# EAGLE design powerswitch (EAGLE 5.11)
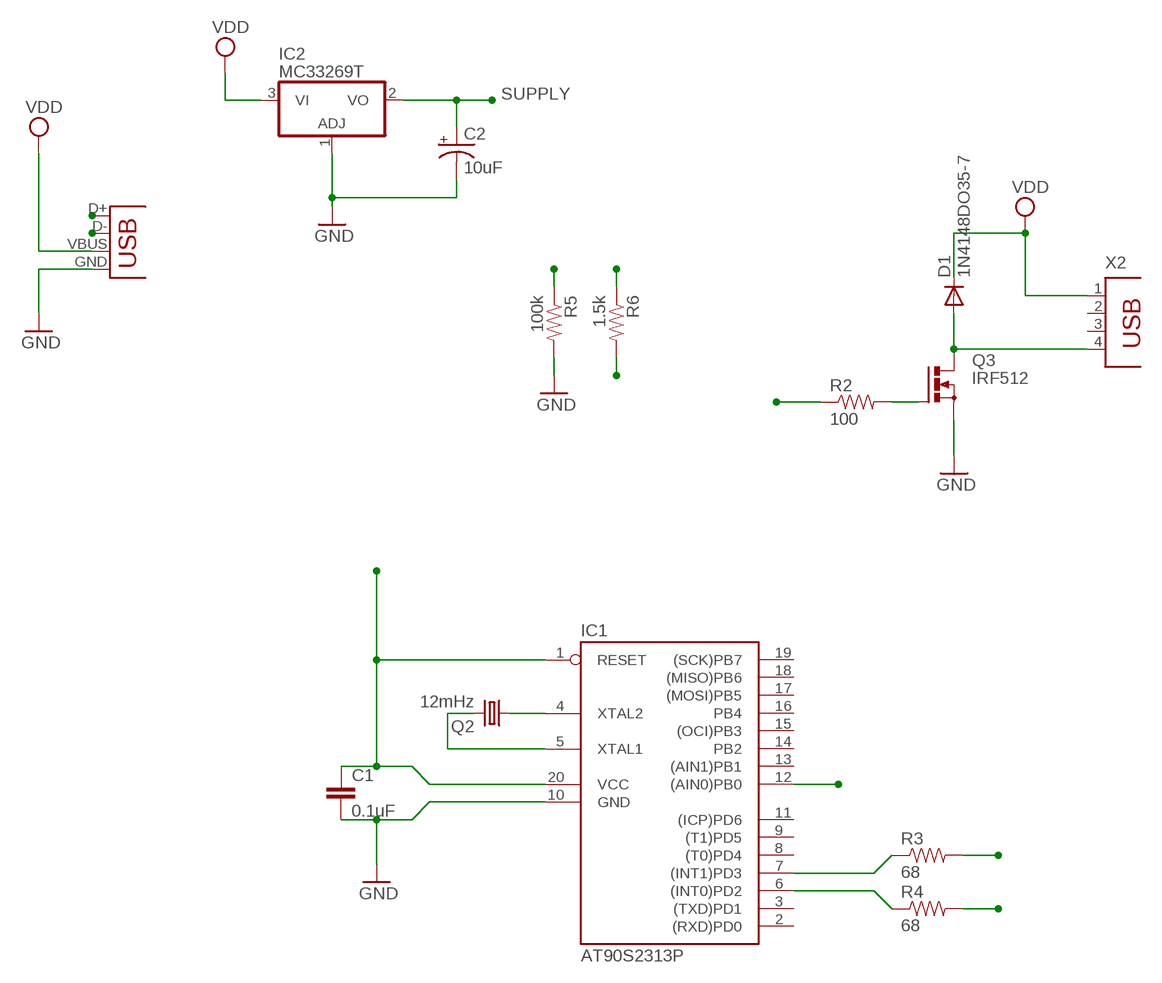
[diagram p0: schematic, sheet 1]

## Parts
C1  0.1uF  CAPPTH  [CAP-PTH-SMALL]
C2  10uF  CAP_POLPTH2  [CPOL-RADIAL-10UF-25V]
D1  1N4148DO35-7  [DO35-7]
IC1  AT90S2313P  [DIL20]
IC2  MC33269T  [TO220V]
Q2  12mHz  CRYSTALHC49U-V  [HC49U-V]
Q3  IRF512  [TO220BV]
R2  100  RESISTORKIT  [AXIAL-0.3-KIT]
R3  68  RESISTORKIT  [AXIAL-0.3-KIT]
R4  68  RESISTORKIT  [AXIAL-0.3-KIT]
R5  100k  RESISTORKIT  [AXIAL-0.3-KIT]
R6  1.5k  RESISTORKIT  [AXIAL-0.3-KIT]
X1  USBPTH  [USB-B-PTH]
X2  PN87520  [PN87520]

## Nets
D+: R4.P$2 R5.P$1 X1.D+
D-: R3.P$2 R6.P$1 X1.D-
GND: C1.2 C2.2(-) IC1.10(GND) IC2.1(ADJ) Q3.S R5.P$2 X1.GND
N$1: IC1.7((INT1)PD3) R3.P$1
N$2: D1.A Q3.D X2.4
N$4: Q3.G R2.P$2
N$5: IC1.6((INT0)PD2) R4.P$1
N$8: IC1.4(XTAL2) Q2.1
N$9: IC1.5(XTAL1) Q2.2
SUPPLY: C1.1 C2.1(+) IC1.1(RESET) IC1.20(VCC) IC2.2(VO) R6.P$2
SWITCH: IC1.12((AIN0)PB0) R2.P$1
VDD: D1.C IC2.3(VI) X1.VBUS X2.1
Unconnected: IC1.2((RXD)PD0) IC1.3((TXD)PD1) IC1.8((T0)PD4) IC1.9((T1)PD5) IC1.11((ICP)PD6) IC1.13((AIN1)PB1) IC1.14(PB2) IC1.15((OCI)PB3) IC1.16(PB4) IC1.17((MOSI)PB5) IC1.18((MISO)PB6) IC1.19((SCK)PB7) X2.2 X2.3

## Library data of the parts
C1 = SparkFun:CAP: Capacitor Standard 0603 ceramic capacitor, and 0.1" leaded capacitor.
C2 = SparkFun:CAP_POL: Capacitor Polarized These are standard SMD and PTH capacitors. Normally 10uF, 47uF, and 100uF in electrolytic and tantalum varieties. Always verify the external diameter of the through hole cap, it varies with capacity, voltage, and manufacturer. The EIA devices should be standard.
D1 = diode:1N4148: DIODE high speed (Philips)
IC1 = atmel:AT90S2313: MICROCONTROLLER 2 Kbytes FLASH 128 bytes SRAM 128 bytes EEPROM UART; OC_FARNELL: unknown; OC_NEWARK: unknown
IC2 = linear:MC33269?*: Adjustable Output Low Dropout Voltage Regulator 800 mA Source: http://www.onsemi.com/pub/Collateral/MC33269-D.PDF
Q2 = crystal:CRYSTAL: CRYSTAL; OC_FARNELL: 1666969; OC_NEWARK: unknown
Q3 = transistor-power:IRF512: N-CHANNEL MOS FET
R2-R6 = SparkFun:RESISTOR: Resistor Basic schematic elements and footprints for 0603, 1206, and PTH resistors.
X1 = SparkFun:USB: USB Connectors USB-B-PTH is fully proven SKU : PRT-00139 USB-miniB is fully proven SKU : PRT-00587 USB-A-PCB is untested. USB-A-H is throughly reviewed, but untested. Spark Fun Electronics SKU : PRT-00437 USB-B-SMT is throughly reviewed, but untested. Needs silkscreen touching up. USB-A-S has not been used/tested USB-MB-H has not been used/tested
X2 = con-berg:PN87520: BERG USB connector; OC_FARNELL: unknown; OC_NEWARK: unknown

## Board
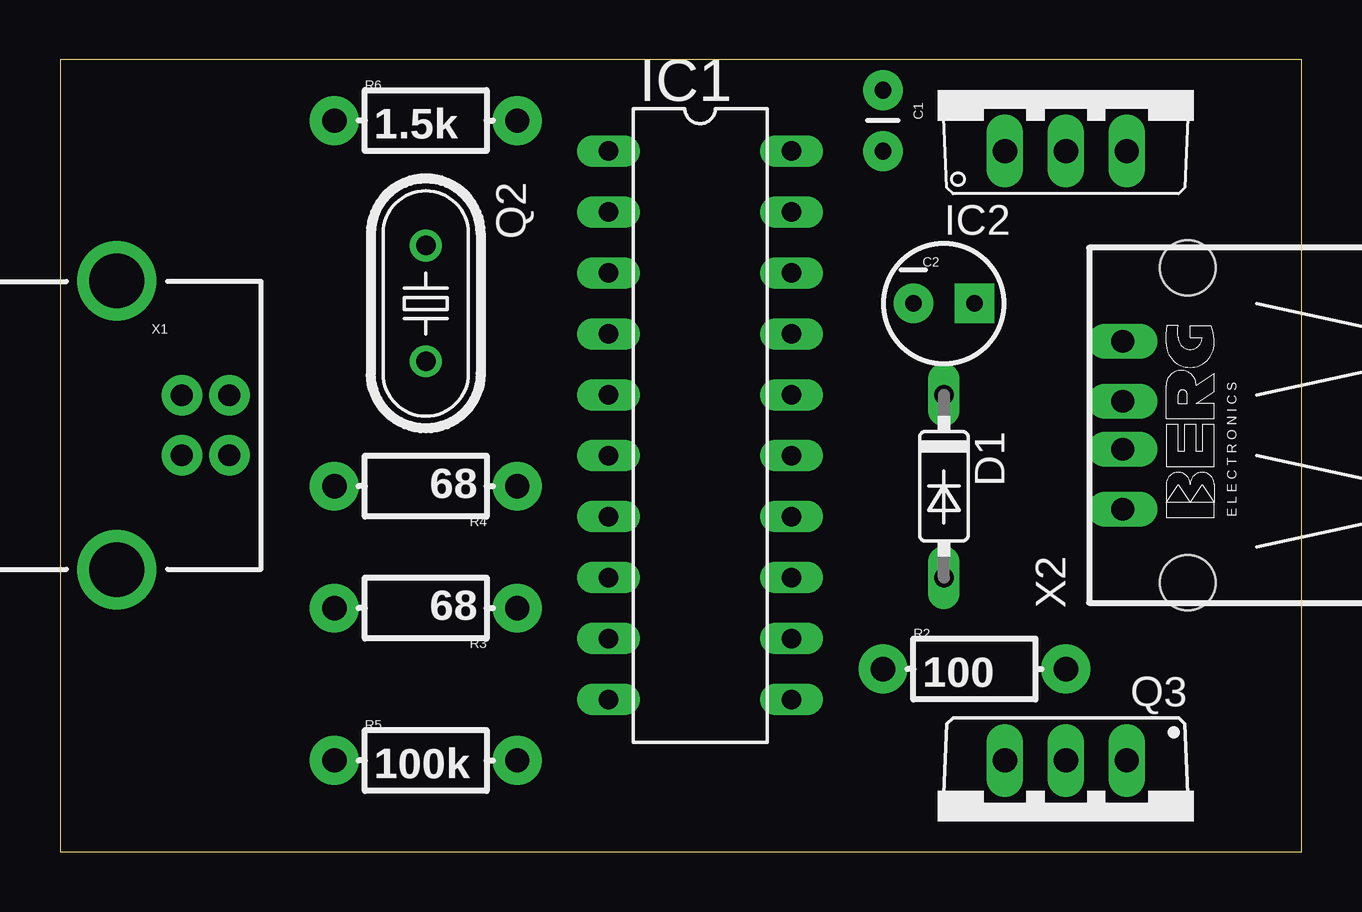
[diagram p1: board, top side]
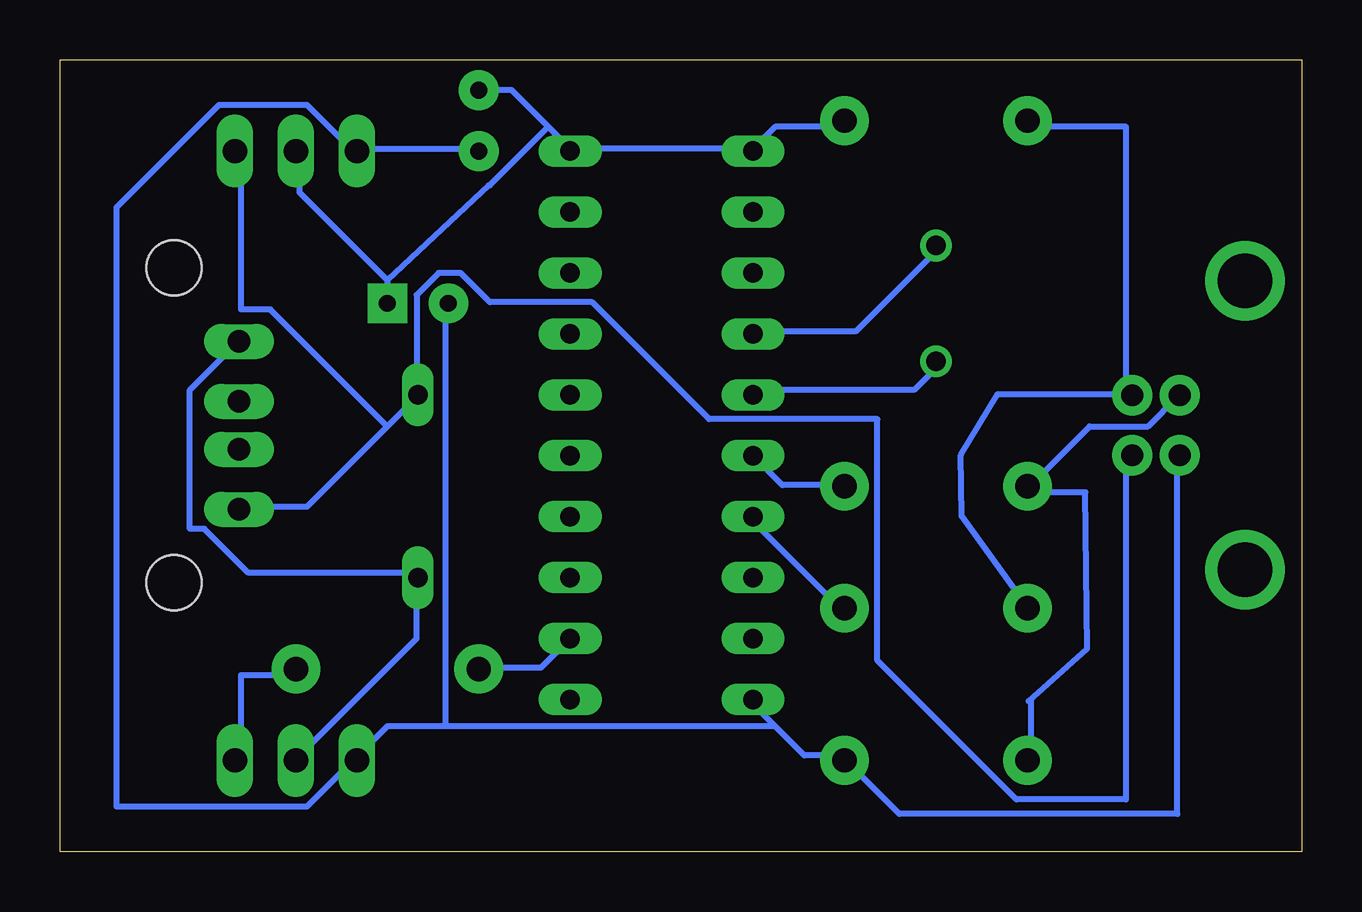
[diagram p2: board, bottom side, seen from below]

Size 51.74 x 33.01 mm. Coordinates in mm from the lower left corner, seen from the top.
Outline: 0,0 51.74,0 51.74,33.01 0,33.01 0,0
Copper layers (1*16): Top 0.035mm / dielectric 1.5mm / Bottom 0.035mm
Design rules "default": minimum track width 10mil, minimum drill 24mil, track to track 8mil, track to pad 8mil, pad to pad 8mil, via to via 8mil, smd to smd 8mil, copper to edge 40mil, drill to drill 8mil, minimum pad ring 10mil, minimum via ring 8mil, stop-mask expansion 4mil, vias tented up to drill 0mil, thermal gap 10mil

### Footprints (pad centres in the part's own frame; a part is rotated, then mirrored left to right if it is on the bottom)
CAP-PTH-SMALL = drill 0.7 pad 1.651 round: 1 0,0; 2 2.54,0
CPOL-RADIAL-10UF-25V = drill 0.7 pad 1.651 square: 1 1.27,0 | drill 0.7 pad 1.651 round: 2 -1.27,0
DO35-7 = drill 0.813 long: A 3.81,0; C -3.81,0
DIL20 = drill 0.813 long: 1 -11.43,-3.81; 2 -8.89,-3.81; 3 -6.35,-3.81; 4 -3.81,-3.81; 5 -1.27,-3.81; 6 1.27,-3.81; 7 3.81,-3.81; 8 6.35,-3.81; 9 8.89,-3.81; 10 11.43,-3.81; 11 11.43,3.81; 12 8.89,3.81; 13 6.35,3.81; 14 3.81,3.81; 15 1.27,3.81; 16 -1.27,3.81; 17 -3.81,3.81; 18 -6.35,3.81; 19 -8.89,3.81; 20 -11.43,3.81
TO220V = drill 1.016 long: 1 -2.54,-2.54; 2 0,-2.54; 3 2.54,-2.54
HC49U-V = drill 0.813 round: 1 -2.413,0; 2 2.413,0
TO220BV = drill 1.016 long: D 0,-2.54; G -2.54,-2.54; S 2.54,-2.54
AXIAL-0.3-KIT = drill 1.016 pad 2.032 round: P$1 -3.81,0; P$2 3.81,0
USB-B-PTH = drill 0.914 pad 1.676 round: D+ 0,1.25; D- 1.981,1.25; GND 0,-1.25; VBUS 1.981,-1.25 | drill 2.286 round: S1 -2.718,-6.02; S2 -2.718,6.02
PN87520 = drill 0.95 long: 1 -3.5,2.71; 2 -1,2.71; 3 1,2.71; 4 3.5,2.71 | hole 2.3: -6.57,0; 6.57,0

### Placement (x,y rotation side)
C1  34.29,31.75 270 top
C2  36.83,22.86 0 top
D1  36.83,15.24 270 top
IC1  26.67,17.78 270 top
IC2  41.91,31.75 0 top
Q2  15.24,22.86 270 top
Q3  41.91,1.27 180 top
R2  38.1,7.62 0 top
R3  15.24,10.16 180 top
R4  15.24,15.24 180 top
R5  15.24,3.81 0 top
R6  15.24,30.48 0 top
X1  5.08,17.78 0 top
X2  46.99,17.78 90 top

### Tracks (layer width: path | path; a pad name or v marks a point on that pad's centre or on a via)
D+
  Bottom 0.254: X1.D+ 5.18,18.95 6.4,17.73 8.84,17.73 11.28,15.29 R4.P$2 11.28,14.99 9.02,14.99 8.94,8.46 11.38,6.27 11.28,6.3 11.28,4.01 R5.P$1
D-
  Bottom 0.254: R6.P$1 11.28,30.23 7.32,30.23 7.32,19.25 X1.D- 6.96,19.05 7.62,19.05 7.19,19.07 12.68,19.07 14.2,16.54 14.17,13.99 11.58,10.41 R3.P$2
GND
  Bottom 0.254: C1.2 34.44,29.31 39.32,29.31 IC2.1 39.62,29.31 41.45,31.14 45.11,31.14 49.38,26.87 49.38,1.88 41.45,1.88 39.62,3.71 Q3.S 39.32,4.01 38.1,5.23 35.66,5.23 | 21.95,5.23 20.73,4.01 19.2,4.01 R5.P$2 18.9,3.71 16.76,1.57 5.18,1.57 5.18,16.51 X1.GND | 21.95,5.23 22.86,6.15 IC1.10 | 21.95,5.23 35.66,5.23 | 35.66,5.23 35.66,22.61 C2.2
N$1
  Bottom 0.254: IC1.7 22.86,13.77 19.51,10.41 19.2,10.41 R3.P$1
N$2
  Bottom 0.254: Q3.D 41.76,4.01 36.88,8.89 36.88,11.33 D1.A 36.88,11.63 43.89,11.63 45.72,13.46 46.33,13.46 46.33,19.25 44.5,21.08 X2.4
N$4
  Bottom 0.254: Q3.G 44.2,4.01 44.2,7.37 42.06,7.37 R2.P$2
N$5
  Bottom 0.254: IC1.6 21.64,15.29 19.2,15.29 R4.P$1
N$8
  Bottom 0.254: Q2.1 15.24,25.04 18.59,21.69 22.86,21.69 IC1.4
N$9
  Bottom 0.254: Q2.2 15.24,20.17 16.15,19.25 22.86,19.25 IC1.5
SUPPLY
  Bottom 0.254: 38.1,23.82 41.76,27.48 41.76,29.01 IC2.2 | 38.1,23.82 C2.1 | 22.86,29.31 21.95,30.23 19.2,30.23 R6.P$2 | 31.39,30.23 32.92,31.75 C1.1 | 30.48,29.31 31.39,30.23 | 22.86,29.31 30.48,29.31 | 22.86,29.31 IC1.1 | 30.48,29.31 IC1.20 | 38.1,23.82 33.88,27.79 33.83,27.79 31.39,30.23
SWITCH
  Bottom 0.254: IC1.12 31.7,7.67 34.14,7.67 R2.P$1
VDD
  Bottom 0.254: 38.1,17.73 41.45,14.38 44.2,14.38 X2.1 | 38.1,17.73 36.88,18.95 D1.C 36.88,19.25 36.88,23.22 35.97,24.13 35.05,24.13 33.83,22.91 29.57,22.91 24.69,18.03 17.68,18.03 17.68,7.98 11.89,2.18 7.32,2.18 7.32,16.51 X1.VBUS | 38.1,17.73 42.98,22.61 44.2,22.61 44.2,29.01 IC2.3